# Altium schematic sheet LED.SchDoc: LED
size A3; DocumentNumber: 1; Revision: 1.0; SheetNumber: 2; SheetTotal: 2; Organization: Công ty cổ phần giải pháp và thiêt bị VHB Việt Nam; Address1: KDT Dương Nội, Hà Đông, Hà Nội
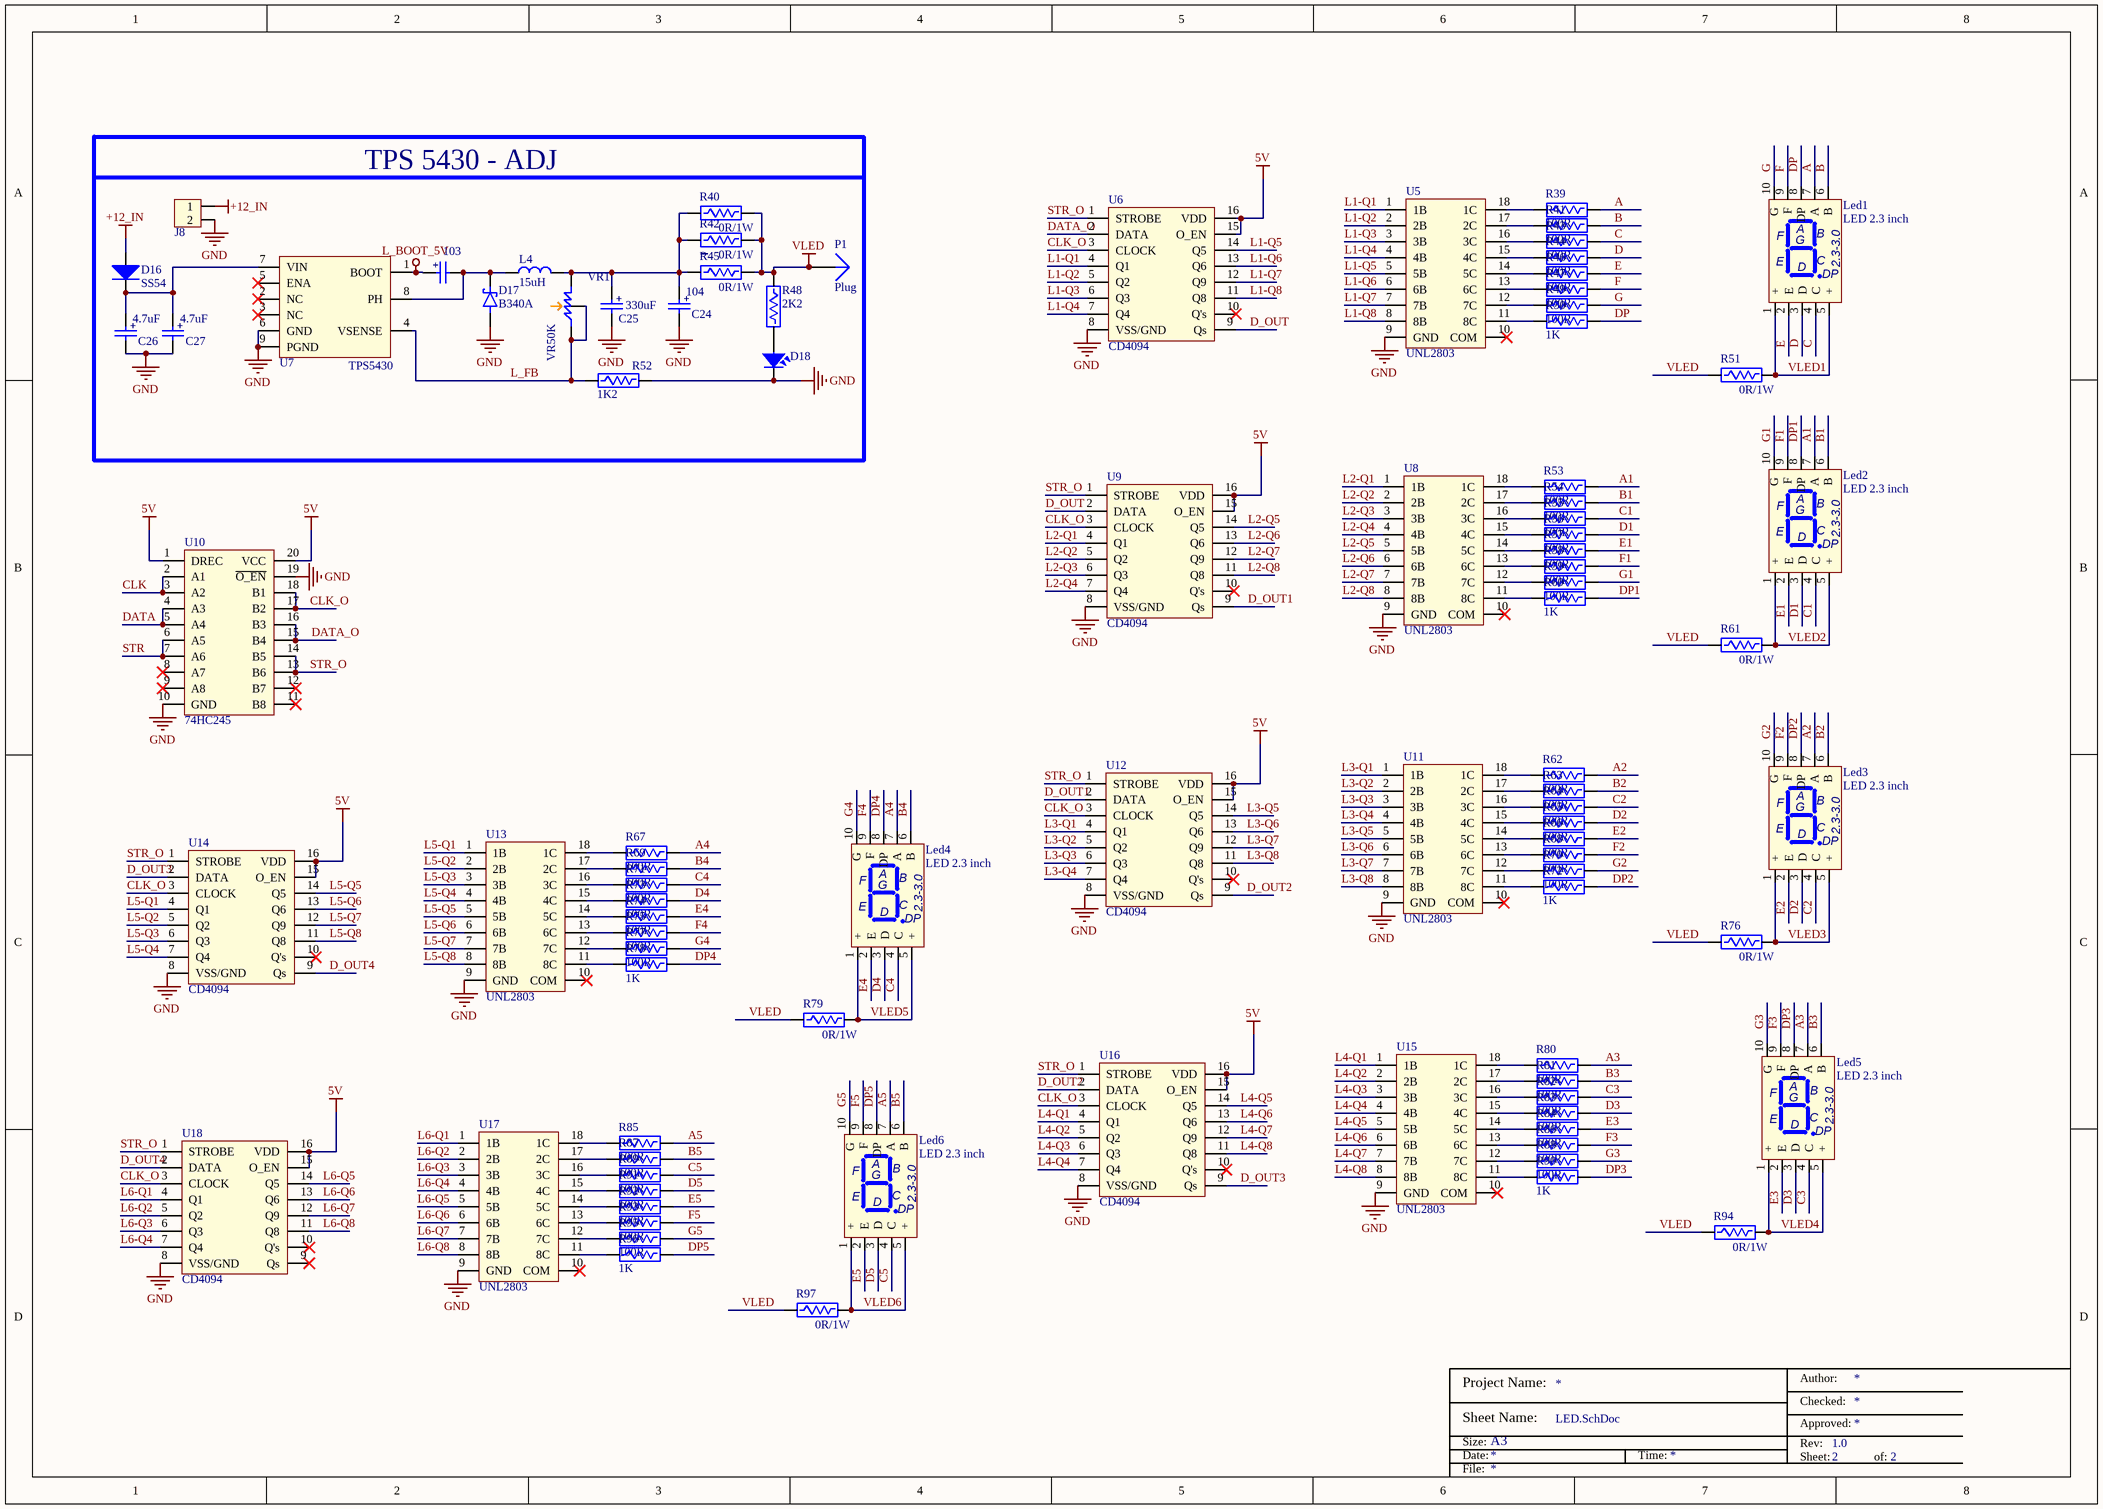
[diagram p0: LED.SchDoc]

## Parts
C23  103  [CAP 0805]
C24  104  [CAP 0805]
C25  330uF  [Capacitor 6x11]
C26  4.7uF  [CAP 0805]
C27  4.7uF  [CAP 0805]
D16  SS54  [Diode SMB]
D17  B340A  [Diode Schotky]
D18  LED RED 0805  [LED SMD 0805]  (value not drawn)
J8  KF128-5.08-2P  [CON KF128-2P]  (value not drawn)
L4  15uH  [Inductor CD75]
Led1  LED 2.3 inch  [LED7SEG 2.3 inch]
Led2  LED 2.3 inch  [LED7SEG 2.3 inch]
Led3  LED 2.3 inch  [LED7SEG 2.3 inch]
Led4  LED 2.3 inch  [LED7SEG 2.3 inch]
Led5  LED 2.3 inch  [LED7SEG 2.3 inch]
Led6  LED 2.3 inch  [LED7SEG 2.3 inch]
P1  Plug  [PIN1]
R39  100R  [Res 0805]
R40  0R/1W  [RES 2512]
R41  100R  [Res 0805]
R42  0R/1W  [RES 2512]
R43  100R  [Res 0805]
R44  100R  [Res 0805]
R45  0R/1W  [RES 2512]
R46  100R  [Res 0805]
R47  100R  [Res 0805]
R48  2K2  [Res 0805]
R49  100R  [Res 0805]
R50  1K  [Res 0805]
R51  0R/1W  [RES 2512]
R52  1K2  [Res 0805]
R53  100R  [Res 0805]
R54  100R  [Res 0805]
R55  100R  [Res 0805]
R56  100R  [Res 0805]
R57  100R  [Res 0805]
R58  100R  [Res 0805]
R59  100R  [Res 0805]
R60  1K  [Res 0805]
R61  0R/1W  [RES 2512]
R62  100R  [Res 0805]
R63  100R  [Res 0805]
R64  100R  [Res 0805]
R65  100R  [Res 0805]
R66  100R  [Res 0805]
R67  100R  [Res 0805]
R68  100R  [Res 0805]
R69  100R  [Res 0805]
R70  100R  [Res 0805]
R71  100R  [Res 0805]
R72  1K  [Res 0805]
R73  100R  [Res 0805]
R74  100R  [Res 0805]
R75  100R  [Res 0805]
R76  0R/1W  [RES 2512]
R77  100R  [Res 0805]
R78  1K  [Res 0805]
R79  0R/1W  [RES 2512]
R80  100R  [Res 0805]
R81  100R  [Res 0805]
R82  100R  [Res 0805]
R83  100R  [Res 0805]
R84  100R  [Res 0805]
R85  100R  [Res 0805]
R86  100R  [Res 0805]
R87  100R  [Res 0805]
R88  100R  [Res 0805]
R89  100R  [Res 0805]
R90  1K  [Res 0805]
R91  100R  [Res 0805]
R92  100R  [Res 0805]
R93  100R  [Res 0805]
R94  0R/1W  [RES 2512]
R95  100R  [Res 0805]
R96  1K  [Res 0805]
R97  0R/1W  [RES 2512]
U5  UNL2803  [UNL2803A]
U6  CD4094  [CD4094]
U7  TPS5430  [SOIC127P600X170-9N]
U8  UNL2803  [UNL2803A]
U9  CD4094  [CD4094]
U10  74HC245  [74HC245-TSSOP20-4.4mm]
U11  UNL2803  [UNL2803A]
U12  CD4094  [CD4094]
U13  UNL2803  [UNL2803A]
U14  CD4094  [CD4094]
U15  UNL2803  [UNL2803A]
U16  CD4094  [CD4094]
U17  UNL2803  [UNL2803A]
U18  CD4094  [CD4094]
VR1  VR50K  [VR 3296W]

## Blocks framed on the sheet
TPS 5430 - ADJ: C23-C27 D16-D18 J8 L4 P1 R40 R42 R45 R48 R52 U7 VR1

## Nets
5V: U6.15(O_EN) U6.16(VDD) U9.15(O_EN) U9.16(VDD) U10.1(DREC) U10.20(VCC) U12.15(O_EN) U12.16(VDD) U14.15(O_EN) U14.16(VDD) U16.15(O_EN) U16.16(VDD) U18.15(O_EN) U18.16(VDD)
+12_IN: D16.1(A) J8.1
GND: C24.2 C25.2 C26.2 C27.2 D17.A D18.2 J8.2 R52.2 U5.9(GND) U6.8(VSS/GND) U7.6(GND) U7.9(PGND) U8.9(GND) U9.8(VSS/GND) U10.10(GND) U10.19(~{O_EN}) U11.9(GND) U12.8(VSS/GND) U13.9(GND) U14.8(VSS/GND) U15.9(GND) U16.8(VSS/GND) U17.9(GND) U18.8(VSS/GND)
L_BOOT_5V: C23.1 U7.1(BOOT)
VLED: P1.1 R40.2 R42.2 R45.2 R48.1 R51.1 R61.1 R76.1 R79.1 R94.1 R97.1
A: Led1.7(A) R39.2
A1: Led2.7(A) R53.2
A2: Led3.7(A) R62.2
A3: Led5.7(A) R80.2
A4: Led4.7(A) R67.2
A5: Led6.7(A) R85.2
B: Led1.6(B) R41.2
B1: Led2.6(B) R54.2
B2: Led3.6(B) R63.2
B3: Led5.6(B) R81.2
B4: Led4.6(B) R69.2
B5: Led6.6(B) R87.2
C: Led1.4(C) R43.2
C1: Led2.4(C) R55.2
C2: Led3.4(C) R64.2
C3: Led5.4(C) R82.2
C4: Led4.4(C) R71.2
C5: Led6.4(C) R89.2
CLK: U10.2(A1) U10.3(A2)
CLK_O: U6.3(CLOCK) U9.3(CLOCK) U10.17(B2) U10.18(B1) U12.3(CLOCK) U14.3(CLOCK) U16.3(CLOCK) U18.3(CLOCK)
D: Led1.3(D) R44.2
D1: Led2.3(D) R56.2
D2: Led3.3(D) R65.2
D3: Led5.3(D) R83.2
D4: Led4.3(D) R73.2
D5: Led6.3(D) R91.2
D_OUT: U6.9(Qs) U9.2(DATA)
D_OUT1: U9.9(Qs) U12.2(DATA)
D_OUT2: U12.9(Qs) U16.2(DATA)
D_OUT3: U14.2(DATA) U16.9(Qs)
D_OUT4: U14.9(Qs) U18.2(DATA)
DATA: U10.4(A3) U10.5(A4)
DATA_O: U6.2(DATA) U10.15(B4) U10.16(B3)
DP: Led1.8(DP) R50.2
DP1: Led2.8(DP) R60.2
DP2: Led3.8(DP) R72.2
DP3: Led5.8(DP) R90.2
DP4: Led4.8(DP) R78.2
DP5: Led6.8(DP) R96.2
E: Led1.2(E) R46.2
E1: Led2.2(E) R57.2
E2: Led3.2(E) R66.2
E3: Led5.2(E) R84.2
E4: Led4.2(E) R74.2
E5: Led6.2(E) R92.2
F: Led1.9(F) R47.2
F1: Led2.9(F) R58.2
F2: Led3.9(F) R68.2
F3: Led5.9(F) R86.2
F4: Led4.9(F) R75.2
F5: Led6.9(F) R93.2
G: Led1.10(G) R49.2
G1: Led2.10(G) R59.2
G2: Led3.10(G) R70.2
G3: Led5.10(G) R88.2
G4: Led4.10(G) R77.2
G5: Led6.10(G) R95.2
L1-Q1: U5.1(1B) U6.4(Q1)
L1-Q2: U5.2(2B) U6.5(Q2)
L1-Q3: U5.3(3B) U6.6(Q3)
L1-Q4: U5.4(4B) U6.7(Q4)
L1-Q5: U5.5(5B) U6.14(Q5)
L1-Q6: U5.6(6B) U6.13(Q6)
L1-Q7: U5.7(7B) U6.12(Q9)
L1-Q8: U5.8(8B) U6.11(Q8)
L2-Q1: U8.1(1B) U9.4(Q1)
L2-Q2: U8.2(2B) U9.5(Q2)
L2-Q3: U8.3(3B) U9.6(Q3)
L2-Q4: U8.4(4B) U9.7(Q4)
L2-Q5: U8.5(5B) U9.14(Q5)
L2-Q6: U8.6(6B) U9.13(Q6)
L2-Q7: U8.7(7B) U9.12(Q9)
L2-Q8: U8.8(8B) U9.11(Q8)
L3-Q1: U11.1(1B) U12.4(Q1)
L3-Q2: U11.2(2B) U12.5(Q2)
L3-Q3: U11.3(3B) U12.6(Q3)
L3-Q4: U11.4(4B) U12.7(Q4)
L3-Q5: U11.5(5B) U12.14(Q5)
L3-Q6: U11.6(6B) U12.13(Q6)
L3-Q7: U11.7(7B) U12.12(Q9)
L3-Q8: U11.8(8B) U12.11(Q8)
L4-Q1: U15.1(1B) U16.4(Q1)
L4-Q2: U15.2(2B) U16.5(Q2)
L4-Q3: U15.3(3B) U16.6(Q3)
L4-Q4: U15.4(4B) U16.7(Q4)
L4-Q5: U15.5(5B) U16.14(Q5)
L4-Q6: U15.6(6B) U16.13(Q6)
L4-Q7: U15.7(7B) U16.12(Q9)
L4-Q8: U15.8(8B) U16.11(Q8)
L5-Q1: U13.1(1B) U14.4(Q1)
L5-Q2: U13.2(2B) U14.5(Q2)
L5-Q3: U13.3(3B) U14.6(Q3)
L5-Q4: U13.4(4B) U14.7(Q4)
L5-Q5: U13.5(5B) U14.14(Q5)
L5-Q6: U13.6(6B) U14.13(Q6)
L5-Q7: U13.7(7B) U14.12(Q9)
L5-Q8: U13.8(8B) U14.11(Q8)
L6-Q1: U17.1(1B) U18.4(Q1)
L6-Q2: U17.2(2B) U18.5(Q2)
L6-Q3: U17.3(3B) U18.6(Q3)
L6-Q4: U17.4(4B) U18.7(Q4)
L6-Q5: U17.5(5B) U18.14(Q5)
L6-Q6: U17.6(6B) U18.13(Q6)
L6-Q7: U17.7(7B) U18.12(Q9)
L6-Q8: U17.8(8B) U18.11(Q8)
L_FB: R52.1 U7.4(VSENSE) VR1.1 VR1.2
STR: U10.6(A5) U10.7(A6)
STR_O: U6.1(STROBE) U9.1(STROBE) U10.13(B6) U10.14(B5) U12.1(STROBE) U14.1(STROBE) U16.1(STROBE) U18.1(STROBE)
VLED1: Led1.1(+) Led1.5(+) R51.2
VLED2: Led2.1(+) Led2.5(+) R61.2
VLED3: Led3.1(+) Led3.5(+) R76.2
VLED4: Led5.1(+) Led5.5(+) R94.2
VLED5: Led4.1(+) Led4.5(+) R79.2
VLED6: Led6.1(+) Led6.5(+) R97.2
NetC23_2: C23.2 D17.K L4.1 U7.8(PH)
NetC24_1: C24.1 C25.1 L4.2 R40.1 R42.1 R45.1 VR1.3
NetC26_1: C26.1 C27.1 D16.2(K) U7.7(VIN)
NetD18_1: D18.1 R48.2
NetR39_1: R39.1 U5.18(1C)
NetR41_1: R41.1 U5.17(2C)
NetR43_1: R43.1 U5.16(3C)
NetR44_1: R44.1 U5.15(4C)
NetR46_1: R46.1 U5.14(5C)
NetR47_1: R47.1 U5.13(6C)
NetR49_1: R49.1 U5.12(7C)
NetR50_1: R50.1 U5.11(8C)
NetR53_1: R53.1 U8.18(1C)
NetR54_1: R54.1 U8.17(2C)
NetR55_1: R55.1 U8.16(3C)
NetR56_1: R56.1 U8.15(4C)
NetR57_1: R57.1 U8.14(5C)
NetR58_1: R58.1 U8.13(6C)
NetR59_1: R59.1 U8.12(7C)
NetR60_1: R60.1 U8.11(8C)
NetR62_1: R62.1 U11.18(1C)
NetR63_1: R63.1 U11.17(2C)
NetR64_1: R64.1 U11.16(3C)
NetR65_1: R65.1 U11.15(4C)
NetR66_1: R66.1 U11.14(5C)
NetR67_1: R67.1 U13.18(1C)
NetR68_1: R68.1 U11.13(6C)
NetR69_1: R69.1 U13.17(2C)
NetR70_1: R70.1 U11.12(7C)
NetR71_1: R71.1 U13.16(3C)
NetR72_1: R72.1 U11.11(8C)
NetR73_1: R73.1 U13.15(4C)
NetR74_1: R74.1 U13.14(5C)
NetR75_1: R75.1 U13.13(6C)
NetR77_1: R77.1 U13.12(7C)
NetR78_1: R78.1 U13.11(8C)
NetR80_1: R80.1 U15.18(1C)
NetR81_1: R81.1 U15.17(2C)
NetR82_1: R82.1 U15.16(3C)
NetR83_1: R83.1 U15.15(4C)
NetR84_1: R84.1 U15.14(5C)
NetR85_1: R85.1 U17.18(1C)
NetR86_1: R86.1 U15.13(6C)
NetR87_1: R87.1 U17.17(2C)
NetR88_1: R88.1 U15.12(7C)
NetR89_1: R89.1 U17.16(3C)
NetR90_1: R90.1 U15.11(8C)
NetR91_1: R91.1 U17.15(4C)
NetR92_1: R92.1 U17.14(5C)
NetR93_1: R93.1 U17.13(6C)
NetR95_1: R95.1 U17.12(7C)
NetR96_1: R96.1 U17.11(8C)

Not connected (* = marked no-connect by the designer): U5 10(COM)*; U6 10(Q's)*; U7 2(NC)* 3(NC)* 5(ENA)*; U8 10(COM)*; U9 10(Q's)*; U10 8(A7)* 9(A8)* 11(B8)* 12(B7)*; U11 10(COM)*; U12 10(Q's)*; U13 10(COM)*; U14 10(Q's)*; U15 10(COM)*; U16 10(Q's)*; U17 10(COM)*; U18 9(Qs)* 10(Q's)*

## Notes on the sheet
- Project Name:
- Author:
- Size:
- Date:
- Sheet Name:
- A3
- Time:
- Checked:
- Approved:
- Rev:
- Sheet:
- of:
- File:
- (in symbol Capacitor) +
- (in symbol Led7S 2.3 - 3.0 inch) 2.3-3.0

## Library data of the parts
C23-C27 = Capacitor
D16 = Diode
D17 = Diode schottky
D18 = Led Smd
J8 = Con2
L4 = L-Inductor
Led1-Led6 = Led7S 2.3 - 3.0 inch
R39-R97 = Res
VR1 = VR 3296W
P1 = Plug: LatestRevisionDate: 17-Jul-2002; LatestRevisionNote: Re-released for DXP Platform.; Publisher: Altium Limited
U5 U8 U11 U13 U15 U17 = UNL2803: ComponentLink1Description: Datasheet; ComponentLink1URL: https://www.sparkfun.com/datasheets/IC/uln2803a.pdf
U6 U9 U12 U14 U16 U18 = CD4094: Datasheet: https://www.ti.com/lit/gpn/cd4094b; ComponentLink1Description: Datasheet 2; ComponentLink1URL: https://assets.nexperia.com/documents/data-sheet/HEF4094B.pdf
U7 = TPS5430: ComponentLink1Description: Datasheet; ComponentLink1URL: https://www.ti.com/lit/ds/symlink/tps5430.pdf?ts=1670776849209
U10 = 74HC245: ComponentLink1Description: Datasheet; ComponentLink1URL: https://www.mouser.com/datasheet/2/308/74HC245.REV1-69988.pdf